# Altium schematic sheet Sheet1.SchDoc
size A4
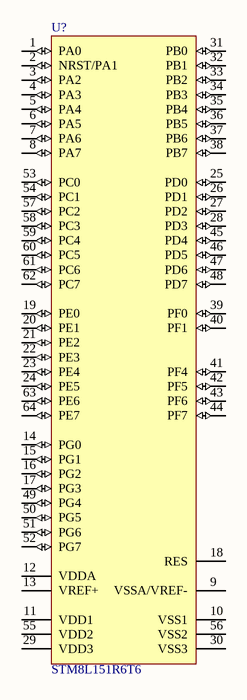
[diagram p0: Sheet1.SchDoc]

## Parts
U?  STM8L151R6T6  [LQFP64_N]

## Nets

Not connected (* = marked no-connect by the designer): U? 1(PA0) 2(NRST/PA1) 3(PA2) 4(PA3) 5(PA4) 6(PA5) 7(PA6) 8(PA7) 9(VSSA/VREF-) 10(VSS1) 11(VDD1) 12(VDDA) 13(VREF+) 14(PG0) 15(PG1) 16(PG2) 17(PG3) 18(RES) 19(PE0) 20(PE1) 21(PE2) 22(PE3) 23(PE4) 24(PE5) 25(PD0) 26(PD1) 27(PD2) 28(PD3) 29(VDD3) 30(VSS3) 31(PB0) 32(PB1) 33(PB2) 34(PB3) 35(PB4) 36(PB5) 37(PB6) 38(PB7) 39(PF0) 40(PF1) 41(PF4) 42(PF5) 43(PF6) 44(PF7) 45(PD4) 46(PD5) 47(PD6) 48(PD7) 49(PG4) 50(PG5) 51(PG6) 52(PG7) 53(PC0) 54(PC1) 55(VDD2) 56(VSS2) 57(PC2) 58(PC3) 59(PC4) 60(PC5) 61(PC6) 62(PC7) 63(PE6) 64(PE7)

## Library data of the parts
U? = CMP-0235-00055-1: STM8L ARM-based EnergyLite 8-bit MCU, 32 kB Flash, 2 kB Internal RAM, -40 to +85°C Temperature, 64-pin LQFP, Tray; ComponentLink3URL: http://www.st.com/internet/com/home/home.jsp; PackageVersion: rev13, Apr-2011; ComponentLink2URL: http://www.st.com/internet/mcu/subclass/1381.jsp; PackageReference: LQFP64; PackageDescription: 64-Pin Low-Profile Quad Flat Pack, 10 x 10 mm Body, 0.5 mm Pitch (LQFP64); ComponentLink2Description: STM8L Family Web Page; ComponentLink1URL: http://www.st.com/internet/com/TECHNICAL_RESOURCES/TECHNICAL_LITERATURE/DATASHEET/CD00284933.pdf; ComponentLink3Description: st.com Home; ComponentLink1Description: STM8L151/152,x8,R6 Datasheet